# Altium schematic sheet OTGW01_opentherm_rev1.SchDoc
size A4; SheetNumber: 3
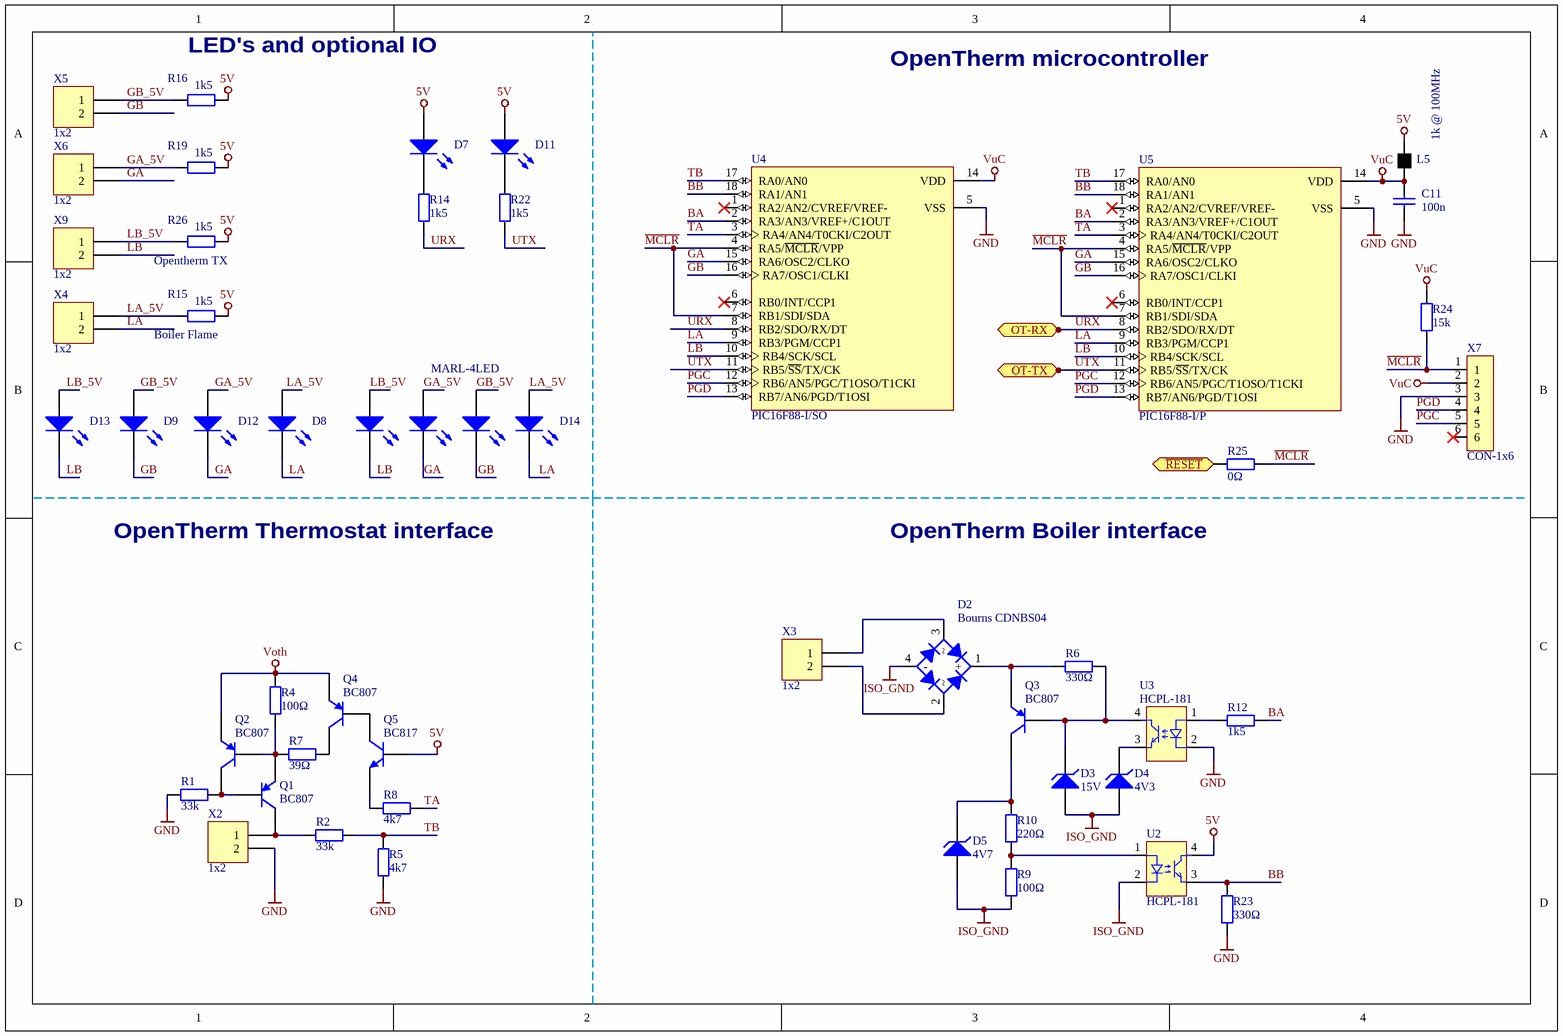
[diagram p0: OTGW01_opentherm_rev1.SchDoc]

## Parts
C11  100n  [0805]
D2  Bourns CDNBS04  [SOD-106]
D3  15V  [SOD123]
D4  4V3  [SOD123]
D5  4V7  [SOD123]
D7  PLCC2 LED  [PLCC2]  (value not drawn)
D8  PLCC2 LED  [PLCC2]  (value not drawn)
D9  PLCC2 LED  [PLCC2]  (value not drawn)
D11  PLCC2 LED  [PLCC2]  (value not drawn)
D12  PLCC2 LED  [PLCC2]  (value not drawn)
D13  PLCC2 LED  [PLCC2]  (value not drawn)
D14  MARL-4LED  [MARL-4LED]
L5  1k @ 100MHz  [0805]
Q1  BC807  [SOT23]
Q2  BC807  [SOT23]
Q3  BC807  [SOT23]
Q4  BC807  [SOT23]
Q5  BC817  [SOT23]
R1  33k  [0805]
R2  33k  [0805]
R4  100Ω  [0805]
R5  4k7  [0805]
R6  330Ω  [0805]
R7  39Ω  [0805]
R8  4k7  [0805]
R9  100Ω  [0805]
R10  220Ω  [0805]
R12  1k5  [0805]
R14  1k5  [0805]
R15  1k5  [0805]
R16  1k5  [0805]
R19  1k5  [0805]
R22  1k5  [0805]
R23  330Ω  [0805]
R24  15k  [0805]
R25  0Ω  [0805]
R26  1k5  [0805]
U2  HCPL-181  [HCPL-181]
U3  HCPL-181  [HCPL-181]
U4  PIC16F88-I/SO  [SOIC18]
U5  PIC16F88-I/P  [PDIP300-P18]
X2  1x2  [Terminal_2x3.5mm]
X3  1x2  [Terminal_2x3.5mm]
X4  1x2  [Terminal_2x3.5mm]
X5  1x2  [Terminal_2x3.5mm]
X6  1x2  [Terminal_2x3.5mm]
X7  CON-1x6  [SIL-1x6-2.54]
X9  1x2  [Terminal_2x3.5mm]

## Ports
OT-RX (in), OT-TX (out), ~{RESET} (in)

## Nets
5V: D7.1(A) D11.1(A) L5.2(OUT) Q5.3(B) R15.2 R16.2 R19.2 R26.2 U2.4(D)
GND: C11.1 R1.1 R5.1 R23.2 U3.2(B) U4.5(VSS) U5.5(VSS) X2.2 X7.3
ISO_GND: D2.4(-) D3.2(Anode) D4.2(Anode) D5.2(Anode) R9.2 U2.2(B)
Voth: Q2.2(E) Q4.2(E) R4.2
VuC: C11.2 L5.1(IN) R24.1 U4.14(VDD) U5.14(VDD) X7.2
~{RESET}: R25.1 ; port ~{RESET}
BA: R12.1 U4.2(RA3/AN3/VREF+/C1OUT) U5.2(RA3/AN3/VREF+/C1OUT)
BB: R23.1 U2.3(C) U4.18(RA1/AN1) U5.18(RA1/AN1)
GA: D12.2(K) D14.6(K) U4.15(RA6/OSC2/CLKO) U5.15(RA6/OSC2/CLKO) X6.2
GA_5V: D12.1(A) D14.5(A) R19.1 X6.1
GB: D9.2(K) D14.4(K) U4.16(RA7/OSC1/CLKI) U5.16(RA7/OSC1/CLKI) X5.2
GB_5V: D9.1(A) D14.3(A) R16.1 X5.1
LA: D8.2(K) D14.2(K) U4.9(RB3/PGM/CCP1) U5.9(RB3/PGM/CCP1) X4.2
LA_5V: D8.1(A) D14.1(A) R15.1 X4.1
LB: D13.2(K) D14.8(K) U4.10(RB4/SCK/SCL) U5.10(RB4/SCK/SCL) X9.2
LB_5V: D13.1(A) D14.7(A) R26.1 X9.1
~{MCLR}: R24.2 R25.2 U4.4(RA5/~{MCLR}/VPP) U4.7(RB1/SDI/SDA) U5.4(RA5/~{MCLR}/VPP) U5.7(RB1/SDI/SDA) X7.1
PGC: U4.12(RB6/AN5/PGC/T1OSO/T1CKI) U5.12(RB6/AN5/PGC/T1OSO/T1CKI) X7.5
PGD: U4.13(RB7/AN6/PGD/T1OSI) U5.13(RB7/AN6/PGD/T1OSI) X7.4
TA: R8.2 U4.3(RA4/AN4/T0CKI/C2OUT) U5.3(RA4/AN4/T0CKI/C2OUT)
TB: R2.2 R5.2 U4.17(RA0/AN0) U5.17(RA0/AN0)
URX: R14.1 U4.8(RB2/SDO/RX/DT) U5.8(RB2/SDO/RX/DT) ; port OT-RX
UTX: R22.1 U4.11(RB5/~{SS}/TX/CK) U5.11(RB5/~{SS}/TX/CK) ; port OT-TX
NetD2_1: D2.1(+) Q3.2(E) R6.2
NetD2_2: D2.2 X3.2
NetD2_3: D2.3 X3.1
NetD3_1: D3.1(Cathode) Q3.1(B) R6.1 U3.4(D)
NetD4_1: D4.1(Cathode) U3.3(C)
NetD5_1: D5.1(Cathode) Q3.3(C) R10.1
NetD7_2: D7.2(K) R14.2
NetD11_2: D11.2(K) R22.2
NetQ1_1: Q1.1(B) Q2.3(C) R1.2
NetQ1_2: Q1.2(E) Q2.1(B) R4.1 R7.1
NetQ1_3: Q1.3(C) R2.1 X2.1
NetQ4_1: Q4.1(B) Q5.2(C)
NetQ4_3: Q4.3(C) R7.2
NetQ5_1: Q5.1(E) R8.1
NetR9_1: R9.1 R10.2 U2.1(A)
NetR12_2: R12.2 U3.1(A)

Not connected (* = marked no-connect by the designer): U4 1(RA2/AN2/CVREF/VREF-)* 6(RB0/INT/CCP1)*; U5 1(RA2/AN2/CVREF/VREF-)* 6(RB0/INT/CCP1)*; X7 6*

## Notes on the sheet
- (near R16) LED's and optional IO
- OpenTherm microcontroller
- (near R26) Opentherm TX
- (near R15) Boiler Flame
- OpenTherm Thermostat interface
- OpenTherm Boiler interface

## Library data of the parts
C11 = C: Capacitor Non Polarized; Supplier 1: Farnell; Supplier Part Number 1: 2470437
D2 = Bridge: Full Wave Diode Bridge; Supplier 1: Farnell; Supplier Part Number 1: 1899476
D3-D5 = D_Z: Zener Diode; Supplier 1: Farnell
  D3: Supplier Part Number 1: 1843720
  D4: Supplier Part Number 1: 2077927
  D5: Supplier Part Number 1: 1902435
D7-D9 D11-D13 = LED: Supplier 1: Farnell; Supplier Part Number 1: 2450615
L5 = Ferrite: Supplier 1: Farnell; Supplier Part Number 1: 1635737
Q1-Q4 = PNP: PNP Medium Power Transistor; Supplier 1: Farnell; Supplier Part Number 1: 2319246
Q5 = NPN: NPN Medium Power Transistor; Supplier 1: Farnell; Supplier Part Number 1: 1081223
R1 R2 R4-R10 R12 R14-R16 R19 R22-R26 = R: Resistor; Supplier 1: Farnell
  R1 R2: Supplier Part Number 1: 9333053
  R4 R9: Supplier Part Number 1: 9332375
  R5 R8: Supplier Part Number 1: 9333266
  R6 R23: Supplier Part Number 1: 9333037
  R7: Supplier Part Number 1: 9333193
  R10: Supplier Part Number 1: 9332804
  R12 R14-R16 R19 R22 R26: Supplier Part Number 1: 9332600
  R24: Supplier Part Number 1: 9332618
  R25: Supplier Part Number 1: 9233750
U4 U5 = MC-8B-16F88-IL18: Supplier 1: Farnell
  U4: Supplier Part Number 1: 9761519
  U5: Supplier Part Number 1: 9761500
X2-X6 X9 = CON_1x2: Supplier 1: Farnell; Supplier Part Number 1: 1098611
D14 = MARL-4LED: Supplier 1: Farnell; Supplier Part Number 1: 9737367
U2 U3 = HCPL-181: Supplier 1: Farnell; Supplier Part Number 1: 1244525